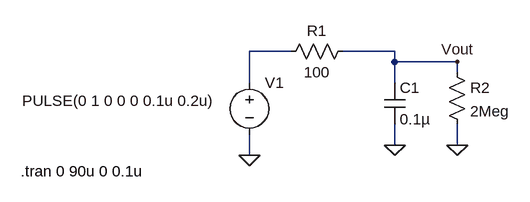
[diagram p0: schematic Filter.asc]
Filter.asc, the LTspice schematic file:
Version 4
SHEET 1 880 680
WIRE 160 80 96 80
WIRE 320 80 240 80
WIRE 320 96 320 80
WIRE 416 96 320 96
WIRE 416 112 416 96
WIRE 96 128 96 80
WIRE 320 128 320 96
WIRE 320 224 320 192
WIRE 416 224 416 192
WIRE 96 240 96 208
FLAG 96 240 0
FLAG 416 224 0
FLAG 320 224 0
FLAG 416 96 Vout
SYMBOL voltage 96 112 R0
WINDOW 3 -350 44 Left 2
WINDOW 123 0 0 Left 0
WINDOW 39 0 0 Left 0
SYMATTR InstName V1
SYMATTR Value PULSE(0 1 0 0 0 0.1u 0.2u)
SYMBOL res 256 64 R90
WINDOW 0 0 56 VBottom 2
WINDOW 3 32 56 VTop 2
SYMATTR InstName R1
SYMATTR Value 100
SYMBOL res 400 96 R0
SYMATTR InstName R2
SYMATTR Value 2Meg
SYMBOL cap 304 128 R0
SYMATTR InstName C1
SYMATTR Value 0.1µ
TEXT -256 264 Left 2 !.tran 0 90u 0 0.1u

The netlist it stands for:
* Filter.asc
V1 N001 0 PULSE(0 1 0 0 0 0.1u 0.2u)
R1 Vout N001 100
R2 Vout 0 2Meg
C1 Vout 0 0.1µ
.tran 0 90u 0 0.1u
.backanno
.end